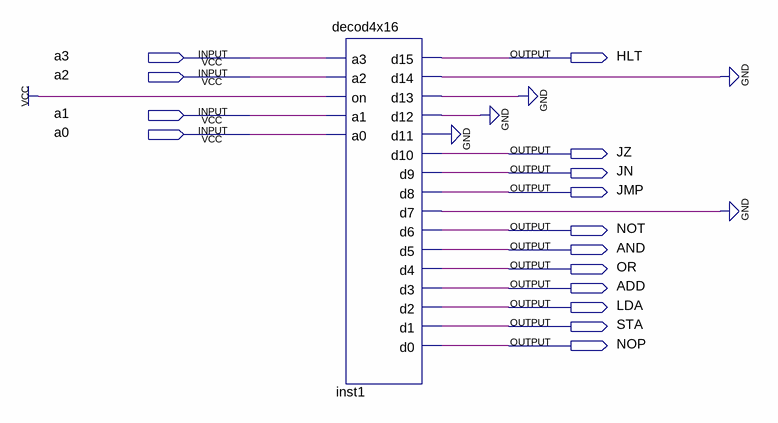
[diagram p0: schematic sheet]
// Quartus schematic decodneanderinstructions.bdf as structural Verilog: 1 symbols, 15 pins
module decodneanderinstructions (
  input  a3,
  input  a2,
  input  a1,
  input  a0,
  output HLT,
  output JZ,
  output JN,
  output JMP,
  output NOT,
  output AND,
  output OR,
  output ADD,
  output LDA,
  output STA,
  output NOP
);

  wire inst1_d7, inst1_d11, inst1_d12, inst1_d13, inst1_d14;

  decod4x16 inst1 (
    .a3(a3), .a2(a2), .on(1'b1), .a1(a1), .a0(a0), .d15(HLT), .d14(inst1_d14), .d13(inst1_d13),
    .d12(inst1_d12), .d11(inst1_d11), .d10(JZ), .d9(JN), .d8(JMP), .d7(inst1_d7), .d6(NOT), .d5(AND),
    .d4(OR), .d3(ADD), .d2(LDA), .d1(STA), .d0(NOP));
  // also tied to GND on the sheet: {inst1_d12, inst1_d13, inst1_d7, inst1_d14, inst1_d11}
endmodule
